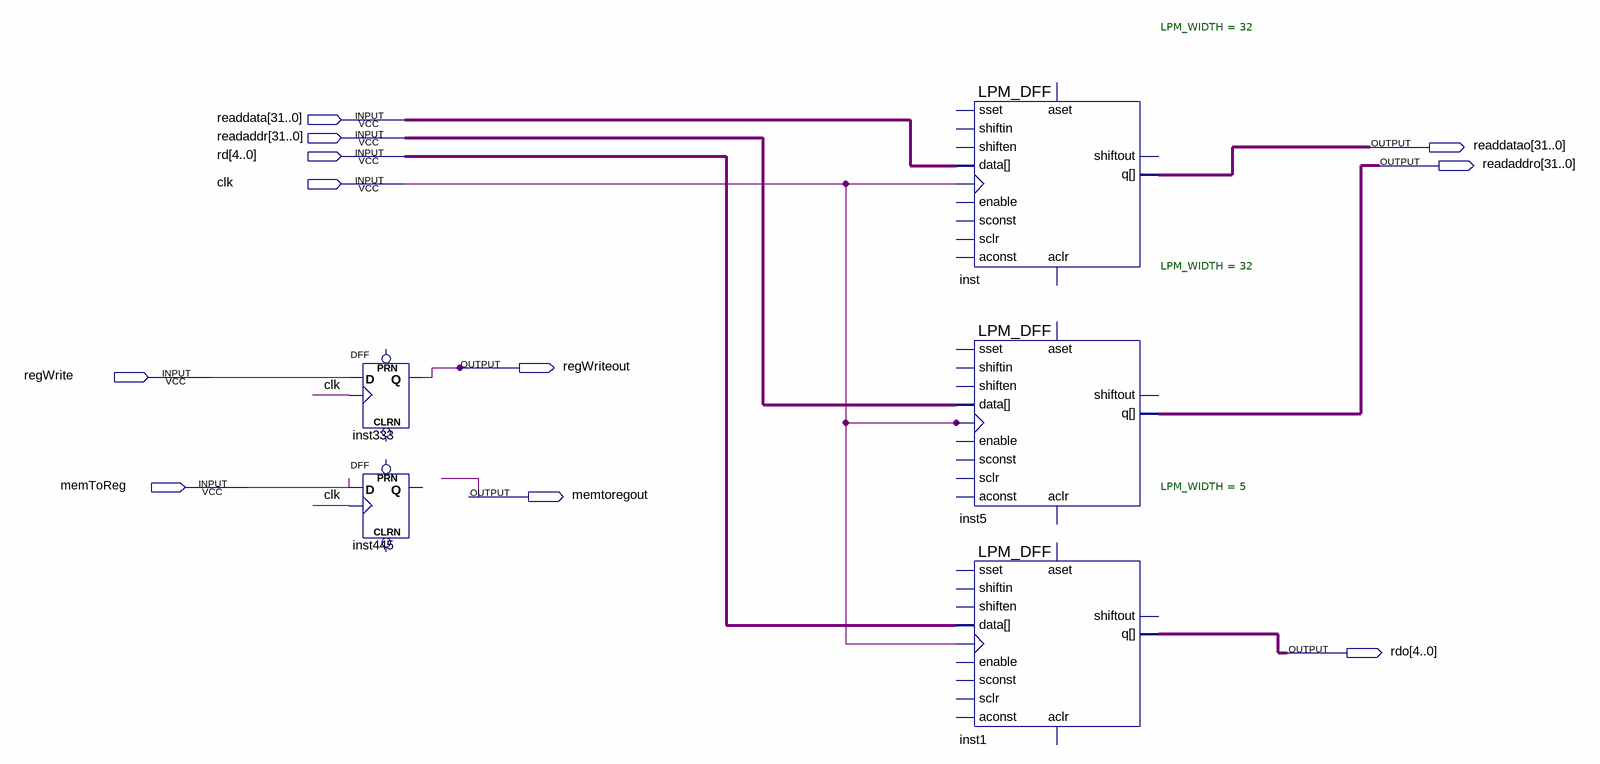
[diagram p0: schematic sheet]
// Quartus schematic memreg.bdf as structural Verilog: 5 symbols, 11 pins
module memreg (
  input  [31:0] readdata,
  input  [31:0] readaddr,
  input  [4:0] rd,
  input  clk,
  input  regWrite,
  input  memToReg,
  output [31:0] readdatao,
  output [31:0] readaddro,
  output regWriteout,
  output memtoregout,
  output [4:0] rdo
);

  DFF inst333 (.CLK(clk), .D(regWrite), .Q(regWriteout));  // open: CLRN, PRN
  DFF inst445 (.CLK(clk), .D(memToReg));  // open: CLRN, PRN, Q
  LPM_DFF #(.LPM_WIDTH(32)) inst (
    .clock(clk), .data(readdata), .q(readdatao));  // open: shiftin, shiften, enable, aconst, sclr, sconst, sset, aset, aclr, shiftout
  LPM_DFF #(.LPM_WIDTH(32)) inst5 (
    .clock(clk), .data(readaddr), .q(readaddro));  // open: shiftin, shiften, enable, aconst, sclr, sconst, sset, aset, aclr, shiftout
  LPM_DFF #(.LPM_WIDTH(5)) inst1 (
    .clock(clk), .data(rd), .q(rdo));  // open: shiftin, shiften, enable, aconst, sclr, sconst, sset, aset, aclr, shiftout
endmodule
